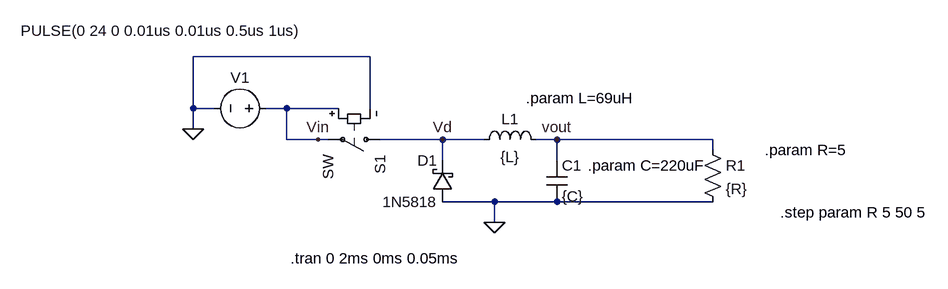
[diagram p0: schematic Draft2.asc]
Draft2.asc, the LTspice schematic file:
Version 4
SHEET 1 880 680
WIRE -32 0 -304 0
WIRE -304 80 -304 0
WIRE -272 80 -304 80
WIRE -160 80 -192 80
WIRE -80 80 -160 80
WIRE -32 80 -32 0
WIRE -304 112 -304 80
WIRE -160 128 -160 80
WIRE -112 128 -160 128
WIRE -96 128 -112 128
WIRE 80 128 -16 128
WIRE 144 128 80 128
WIRE 256 128 224 128
WIRE 496 128 256 128
WIRE 496 144 496 128
WIRE 80 160 80 128
WIRE 256 160 256 128
WIRE 160 224 80 224
WIRE 256 224 160 224
WIRE 496 224 256 224
WIRE 160 256 160 224
FLAG 160 256 0
FLAG -304 112 0
FLAG -112 128 Vin
FLAG 256 128 vout
FLAG 80 128 Vd
SYMBOL ind 128 144 R270
WINDOW 0 32 56 VTop 2
WINDOW 3 5 56 VBottom 2
SYMATTR InstName L1
SYMATTR Value {L}
SYMBOL cap 240 160 R0
SYMATTR InstName C1
SYMATTR Value {C}
SYMBOL schottky 96 224 R180
WINDOW 0 24 64 Left 2
WINDOW 3 24 0 Left 2
SYMATTR InstName D1
SYMATTR Value 1N5818
SYMBOL sw 0 128 R90
SYMATTR InstName S1
SYMBOL voltage -176 80 R90
WINDOW 0 -32 56 VBottom 2
WINDOW 3 -135 177 VTop 2
WINDOW 123 0 0 Left 2
WINDOW 39 0 0 Left 2
SYMATTR InstName V1
SYMATTR Value PULSE(0 24 0 0.01us 0.01us 0.5us 1us)
SYMBOL res 480 128 R0
SYMATTR InstName R1
SYMATTR Value {R}
TEXT 208 64 Left 2 !.param L=69uH
TEXT 304 168 Left 2 !.param C=220uF
TEXT -154 311 Left 2 !.tran 0 2ms 0ms 0.05ms
TEXT 576 144 Left 2 !.param R=5
TEXT 600 240 Left 2 !.step param R 5 50 5

The netlist it stands for:
* Draft2.asc
L1 Vd vout {L}
C1 vout 0 {C}
D1 0 Vd 1N5818
S1 Vd Vin Vin 0 SW
V1 Vin 0 PULSE(0 24 0 0.01us 0.01us 0.5us 1us)
R1 vout 0 {R}
.model D D
.lib standard.dio
.param L=69uH
.param C=220uF
.tran 0 2ms 0ms 0.05ms
.param R=5
.step param R 5 50 5
.backanno
.end